# EAGLE design SparkFun_Qwiic_pHAT_Extension (EAGLE 9.5.2)
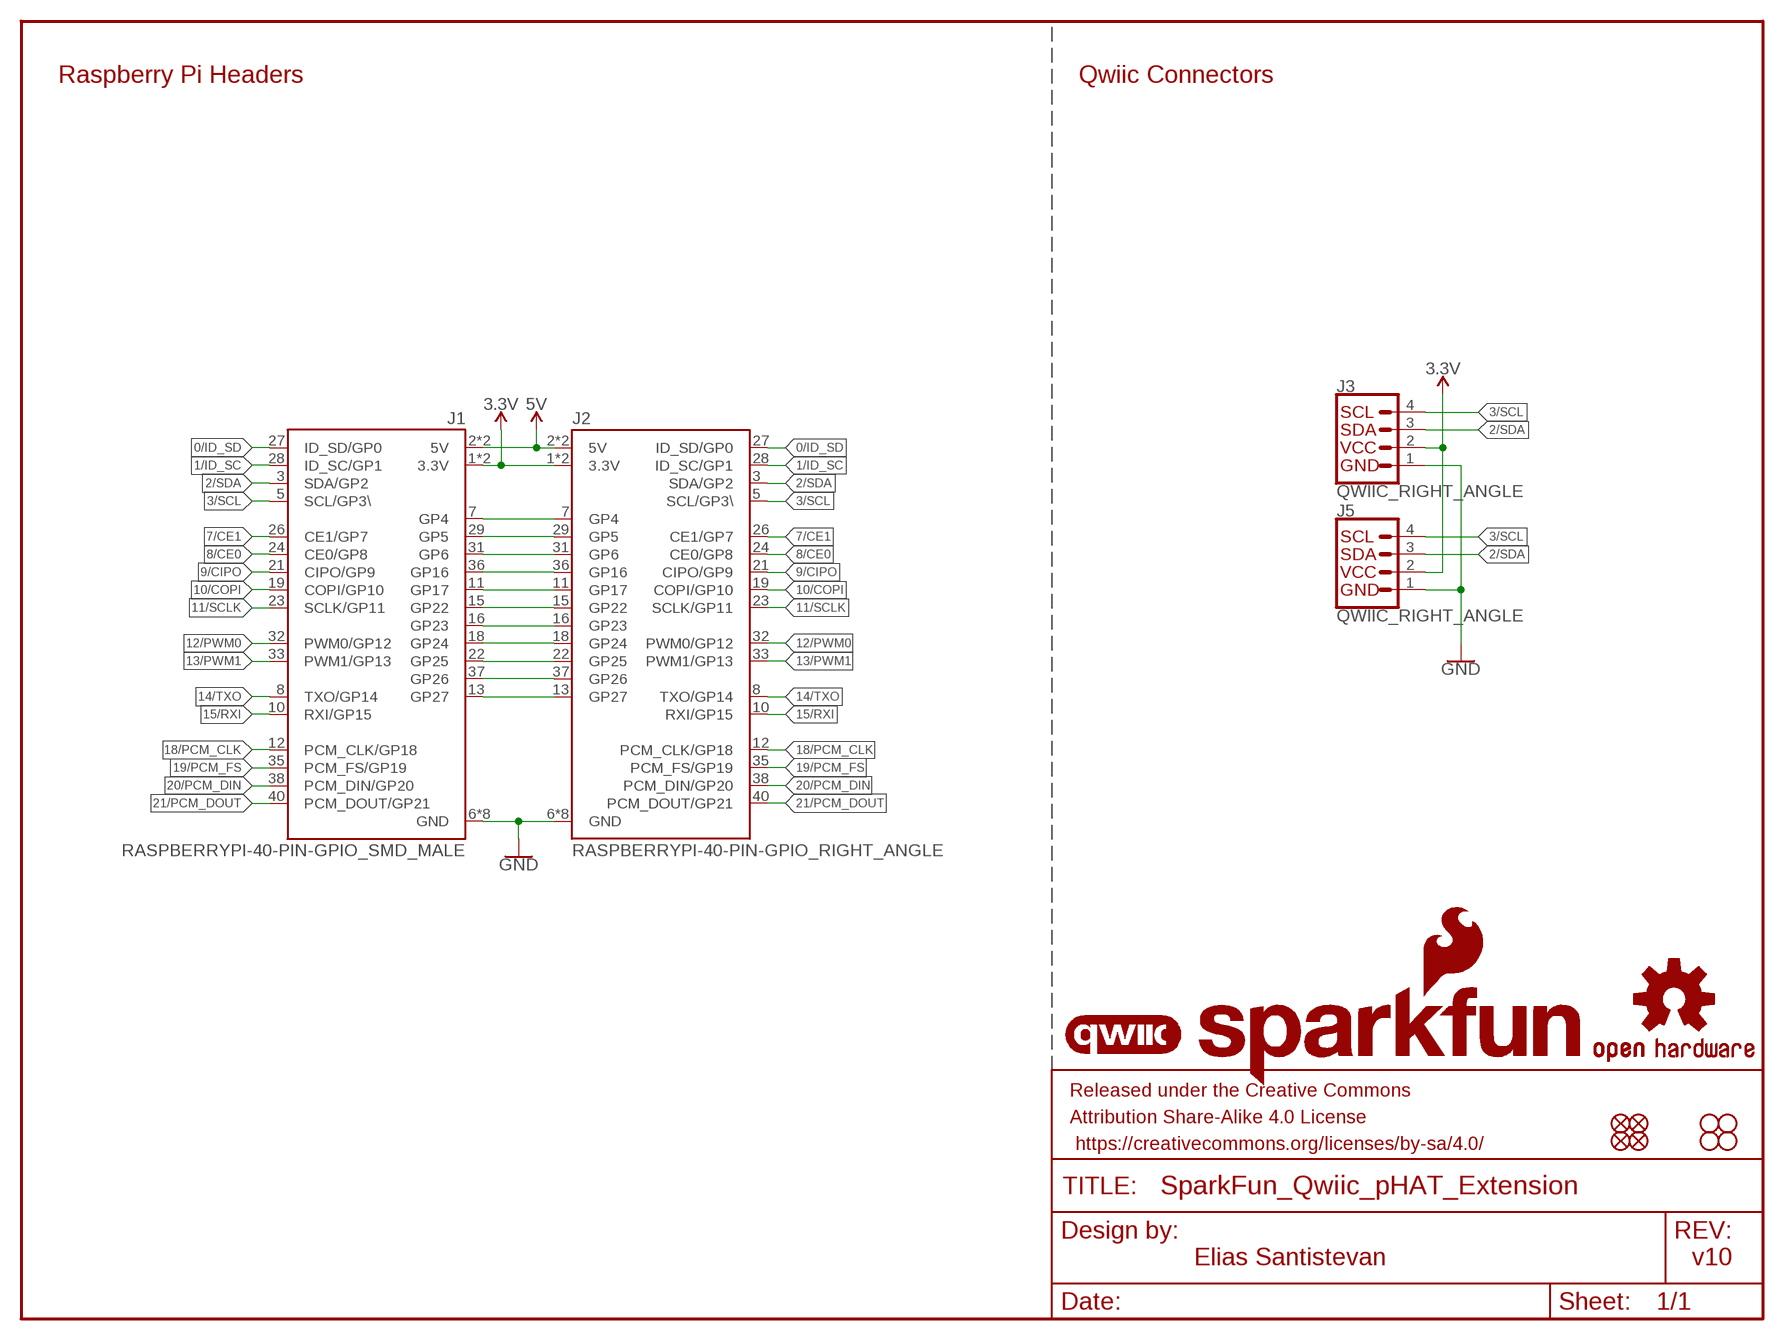
[diagram p0: schematic, sheet 1]

## Parts
FD1  FIDUCIALUFIDUCIAL  [FIDUCIAL-MICRO]
FD2  FIDUCIALUFIDUCIAL  [FIDUCIAL-MICRO]
FD3  FIDUCIALUFIDUCIAL  [FIDUCIAL-MICRO]
FD4  FIDUCIALUFIDUCIAL  [FIDUCIAL-MICRO]
FRAME1  FRAME-LETTER  [CREATIVE_COMMONS]
H1  STAND-OFFTIGHT  [STAND-OFF-TIGHT]
H2  STAND-OFFTIGHT  [STAND-OFF-TIGHT]
H3  STAND-OFFTIGHT  [STAND-OFF-TIGHT]
H4  STAND-OFFTIGHT  [STAND-OFF-TIGHT]
J1  RASPBERRYPI-40-PIN-GPIO_SMD_MALE  [RASPBERRY_PI_HAT_40_PIN_SMD_MALE]
J2  RASPBERRYPI-40-PIN-GPIO_RIGHT_ANGLE  [2X20_RIGHT_ANGLE]
J3  QWIIC_RIGHT_ANGLE  QWIIC_CONNECTORJS-1MM  [JST04_1MM_RA]
J5  QWIIC_RIGHT_ANGLE  QWIIC_CONNECTORJS-1MM  [JST04_1MM_RA]
LOGO1  QWIIC_LOGO_5MM  [QWIIC_5MM]
LOGO2  SFE_LOGO_NAME_FLAME.2_INCH  [SFE_LOGO_NAME_FLAME_.2]
LOGO3  OSHW-LOGOM  [OSHW-LOGO-M]

## Nets
0/ID_SD: J1.27(ID_SD/GP0) J2.27(ID_SD/GP0)
1/ID_SC: J1.28(ID_SC/GP1) J2.28(ID_SC/GP1)
2/SDA: J1.3(SDA/GP2) J2.3(SDA/GP2) J3.3 J5.3
3.3V: J1.1(3.3V) J1.17(3.3V) J2.1(3.3V) J2.17(3.3V) J3.2 J5.2
3/SCL: J1.5(SCL/GP3\) J2.5(SCL/GP3\) J3.4 J5.4
5V: J1.2(5V) J1.4(5V) J2.2(5V) J2.4(5V)
7/CE1: J1.26(CE1/GP7) J2.26(CE1/GP7)
8/CE0: J1.24(CE0/GP8) J2.24(CE0/GP8)
9/CIPO: J1.21(CIPO/GP9) J2.21(CIPO/GP9)
10/COPI: J1.19(COPI/GP10) J2.19(COPI/GP10)
11/SCLK: J1.23(SCLK/GP11) J2.23(SCLK/GP11)
12/PWM0: J1.32(PWM0/GP12) J2.32(PWM0/GP12)
13/PWM1: J1.33(PWM1/GP13) J2.33(PWM1/GP13)
14/TXO: J1.8(TXO/GP14) J2.8(TXO/GP14)
15/RXI: J1.10(RXI/GP15) J2.10(RXI/GP15)
18/PCM_CLK: J1.12(PCM_CLK/GP18) J2.12(PCM_CLK/GP18)
19/PCM_FS: J1.35(PCM_FS/GP19) J2.35(PCM_FS/GP19)
20/PCM_DIN: J1.38(PCM_DIN/GP20) J2.38(PCM_DIN/GP20)
21/PCM_DOUT: J1.40(PCM_DOUT/GP21) J2.40(PCM_DOUT/GP21)
GND: J1.6(GND) J1.9(GND) J1.14(GND) J1.20(GND) J1.25(GND) J1.30(GND) J1.34(GND) J1.39(GND) J2.6(GND) J2.9(GND) J2.14(GND) J2.20(GND) J2.25(GND) J2.30(GND) J2.34(GND) J2.39(GND) J3.1 J5.1
GP4: J1.7(GP4) J2.7(GP4)
GP5: J1.29(GP5) J2.29(GP5)
GP6: J1.31(GP6) J2.31(GP6)
GP16: J1.36(GP16) J2.36(GP16)
GP17: J1.11(GP17) J2.11(GP17)
GP22: J1.15(GP22) J2.15(GP22)
GP23: J1.16(GP23) J2.16(GP23)
GP24: J1.18(GP24) J2.18(GP24)
GP25: J1.22(GP25) J2.22(GP25)
GP26: J1.37(GP26) J2.37(GP26)
GP27: J1.13(GP27) J2.13(GP27)

## Notes on the sheet
- Raspberry Pi Headers | Qwiic Connectors
- Elias Santistevan | v10

## Library data of the parts
FD1-FD4 = SparkFun-Aesthetics:FIDUCIAL: Fiducial Alignment Points Point-of-reference for pick-and-place machines and other optical instruments.
FRAME1 = SparkFun-Aesthetics:FRAME-LETTER: Schematic Frame - Letter Standard 8.5x11 US Letter frame
H1-H4 = SparkFun-Hardware:STAND-OFF: Stand Off Drill holes for mechanically mounting via screws, standoffs, etc. Note: Use the keepout ring to avoid running the screw head into surrounding components. Variant Overviews STAND-OFF - Mechanical footprint for a #4 phillips button head screw. STAND-OFF-TIGHT - Mechanical footprint for a #4 phillips button head screw, Example SparkFun Products Screw - Phillips Head (1/4", 4-40, 10 pack) <https://www.sparkfun.com/products/10453> (PRT-10453) Screw - Phillips Head (1/2", 4-40, 10 pack) <https://www.sparkfun.com/products/10452> (PRT-10452) Screw - Phillips Head (3/4", 4-40, 10 pack) <https://www.sparkfun.com/products/10451> (PRT-10451) Screw - Phillips Head (1", 4-40, 10 pack) <https://www.sparkfun.com/products/10450> (PRT-10450)
J1 = SparkFun-Connectors:RASPBERRYPI-40-PIN-GPIO: Raspberry Pi GPIO Header 2x20 pin connector, as found on B, B+, A+ models. Both shrouded PTH and SMT versions available. SparkFun Products: GPIO Shrouded Header <https://www.sparkfun.com/products/13054>- PTH SparkFun Pi Wedge (Preassembled) <https://www.sparkfun.com/products/13717>; PROD_ID: CONN-14915
J2 = SparkFun-Connectors:RASPBERRYPI-40-PIN-GPIO: Raspberry Pi GPIO Header 2x20 pin connector, as found on B, B+, A+ models. Both shrouded PTH and SMT versions available. SparkFun Products: GPIO Shrouded Header <https://www.sparkfun.com/products/13054>- PTH SparkFun Pi Wedge (Preassembled) <https://www.sparkfun.com/products/13717>
J3 J5 = SparkFun-Connectors:QWIIC_CONNECTOR: SparkFun I2C Standard Qwiic Connector An SMD 1mm pitch JST connector makes it easy and quick (get it? Qwiic?) to connect I2C devices to each other. The Qwiic system <http://www.sparkfun.com/qwiic> enables fast and solderless connection between popular platforms and various sensors and actuators. We carry 200mm <https://www.sparkfun.com/products/14204>, 100mm <https://www.sparkfun.com/products/14205>, 50mm <https://www.sparkfun.com/products/14206>, and breadboard friendly <https://www.sparkfun.com/products/14207> Qwiic cables. We also offer 10 pcs strips <https://www.sparkfun.com/products/14323> the SMD connectors.; PROD_ID: CONN-13694
LOGO1 = SparkFun-Aesthetics:QWIIC_LOGO: Qwiic Logos for placement on schematic and PCB. The 5.5mm silk logo is best for placing next to Qwiic connector.
LOGO2 = SparkFun-Aesthetics:SFE_LOGO_NAME_FLAME: SparkFun Font Logo w/ Flame This is the SparkFun full logo. The logo on the schematic will always be the same size; the package variant is the height of the flame part of the logo. Default layer for the logo on the board is tSilk.
LOGO3 = SparkFun-Aesthetics:OSHW-LOGO: Open-Source Hardware (OSHW) Logo This logo indicates the piece of hardware it is found on incorporates a OSHW license and/or adheres to the definition of open source hardware found here: http://freedomdefined.org/OSHW

## Board
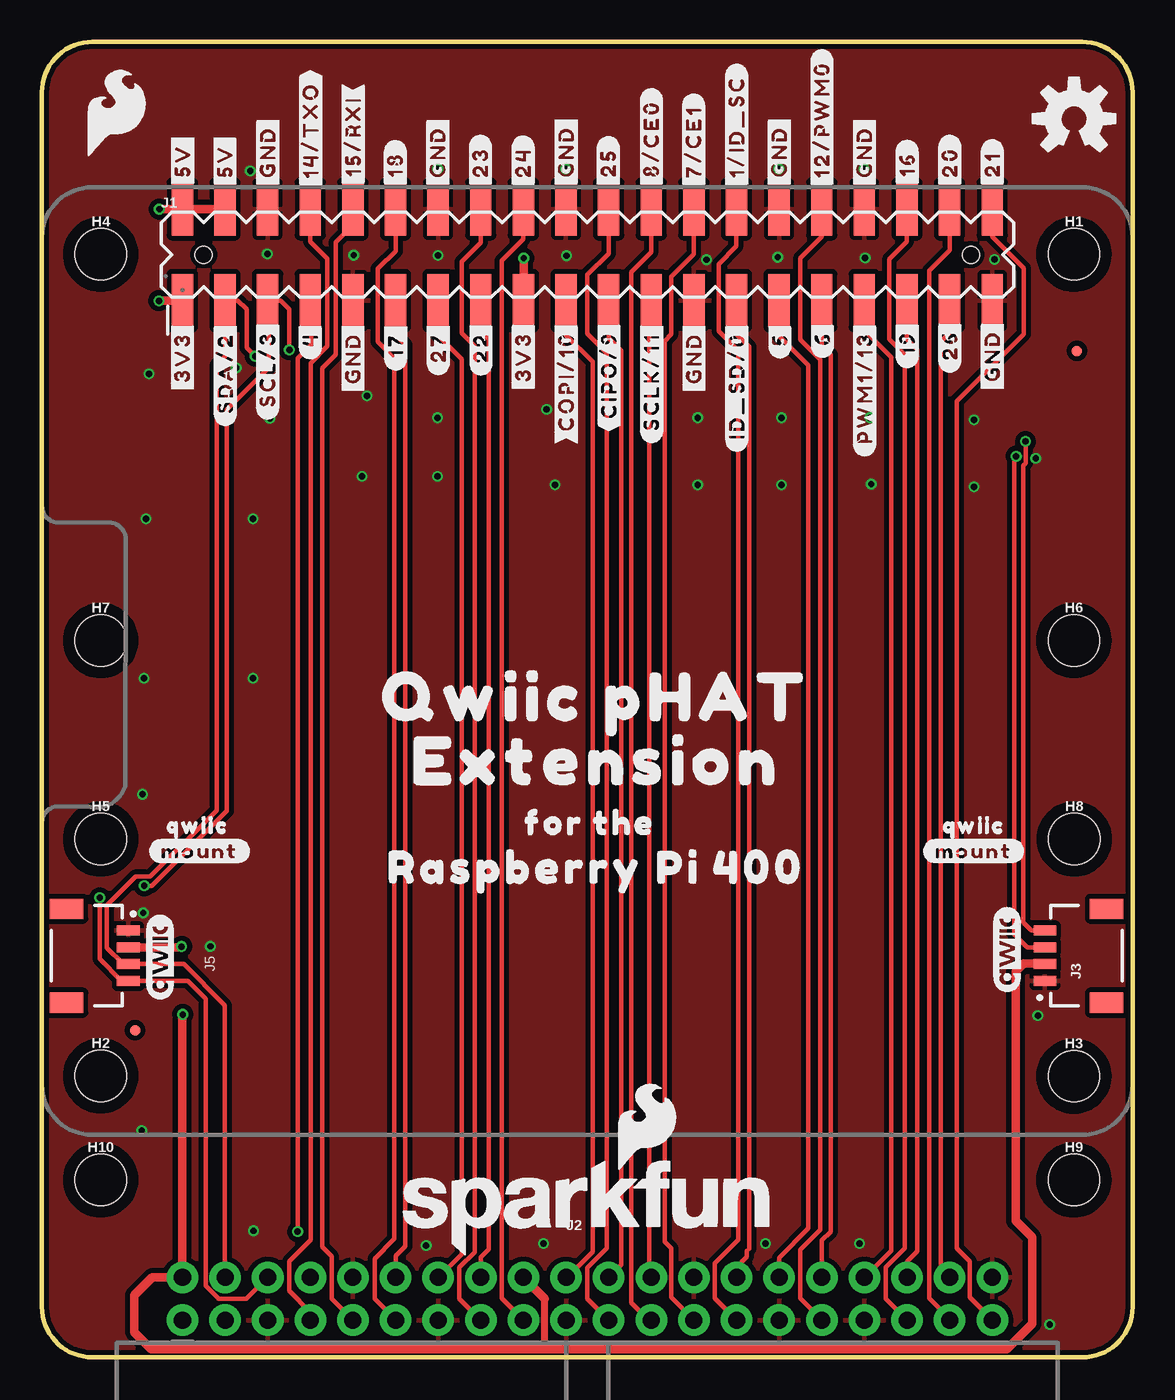
[diagram p1: board, top side]
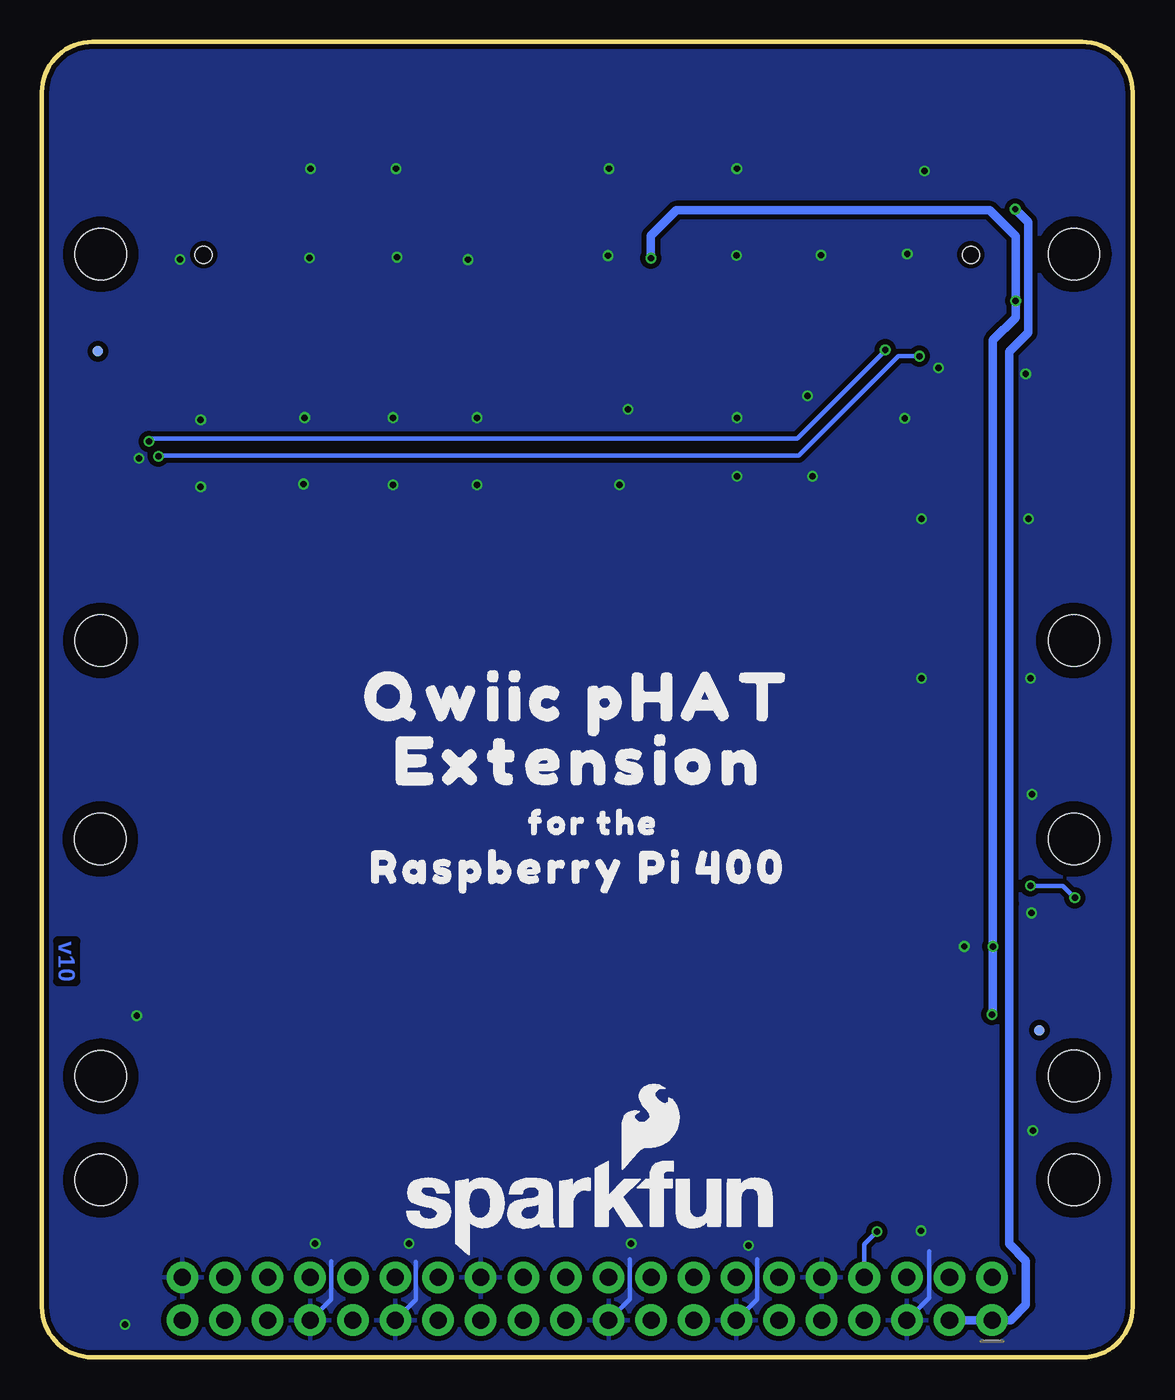
[diagram p2: board, bottom side, seen from below]

Size 65 x 78.42 mm. Coordinates in mm from the lower left corner, seen from the top.
Outline: 0,75.42 0,3 arc90 3,0 62,0 arc90 65,3 65,75.42 arc90 62,78.42 3,78.42 arc90 0,75.42
Copper layers (1*16): Top 0.035mm / dielectric 1.5mm / Bottom 0.035mm
Design rules "SparkFun-2-layer-FAB-LIMIT": minimum track width 4mil, minimum drill 6mil, track to track 4mil, track to pad 4mil, pad to pad 4mil, via to via 4mil, smd to smd 4mil, copper to edge 4mil, drill to drill 4mil, minimum pad ring 5mil, minimum via ring 5mil, stop-mask expansion 4mil, vias tented up to drill 25mil, thermal gap 10mil

### Footprints (pad centres in the part's own frame; a part is rotated, then mirrored left to right if it is on the bottom)
FIDUCIAL-MICRO = smd 0.635 x 0.635: 1 0,0
STAND-OFF-TIGHT = hole 3.048: 0,0
RASPBERRY_PI_HAT_40_PIN_SMD_MALE = smd 1.27 x 3.175: 1 0,-1.46; 2 0,4; 3 2.54,-1.46; 4 2.54,4; 5 5.08,-1.46; 6 5.08,4; 7 7.62,-1.46; 8 7.62,4; 9 10.16,-1.46; 10 10.16,4; 11 12.7,-1.46; 12 12.7,4; 13 15.24,-1.46; 14 15.24,4; 15 17.78,-1.46; 16 17.78,4; 17 20.32,-1.46; 18 20.32,4; 19 22.86,-1.46; 20 22.86,4; 21 25.4,-1.46; 22 25.4,4; 23 27.94,-1.46; 24 27.94,4; 25 30.48,-1.46; 26 30.48,4; 27 33.02,-1.46; 28 33.02,4; 29 35.56,-1.46; 30 35.56,4; 31 38.1,-1.46; 32 38.1,4; 33 40.64,-1.46; 34 40.64,4; 35 43.18,-1.46; 36 43.18,4; 37 45.72,-1.46; 38 45.72,4; 39 48.26,-1.46; 40 48.26,4 | hole 1: 1.27,1.27; 46.99,1.27
2X20_RIGHT_ANGLE = drill 1.016 pad 1.88: 1 -24.125,1.25; 2 -24.125,-1.29; 3 -21.585,1.25; 4 -21.585,-1.29; 5 -19.045,1.25; 6 -19.045,-1.29; 7 -16.505,1.25; 8 -16.505,-1.29; 9 -13.965,1.25; 10 -13.965,-1.29; 11 -11.425,1.25; 12 -11.425,-1.29; 13 -8.885,1.25; 14 -8.885,-1.29; 15 -6.345,1.25; 16 -6.345,-1.29; 17 -3.805,1.25; 18 -3.805,-1.29; 19 -1.265,1.25; 20 -1.265,-1.29; 21 1.275,1.25; 22 1.275,-1.29; 23 3.815,1.25; 24 3.815,-1.29; 25 6.355,1.25; 26 6.355,-1.29; 27 8.895,1.25; 28 8.895,-1.29; 29 11.435,1.25; 30 11.435,-1.29; 31 13.975,1.25; 32 13.975,-1.29; 33 16.515,1.25; 34 16.515,-1.29; 35 19.055,1.25; 36 19.055,-1.29; 37 21.595,1.25; 38 21.595,-1.29; 39 24.135,1.25; 40 24.135,-1.29
JST04_1MM_RA = smd 0.6 x 1.35: 1 -1.5,0; 2 -0.5,0; 3 0.5,0; 4 1.5,0 | smd 1.2 x 2: NC1 2.8,-3.675; NC2 -2.8,-3.675

### Placement (x,y rotation side)
FD1  5.55,19.49 0 top
FD2  61.67,59.99 0 top
FD3  61.67,59.98 0 bottom
FD4  5.55,19.49 0 bottom
FRAME1  17.1,-15.9 0 top  (outside the outline)
H1  61.5,65.76 0 top
H2  3.5,16.78 0 top
H3  61.5,16.76 0 top
H4  3.5,65.76 0 top
H5  STAND-OFFTIGHT  [STAND-OFF-TIGHT]  3.5,30.9 0 top
H6  STAND-OFFTIGHT  [STAND-OFF-TIGHT]  61.5,42.74 0 top
H7  STAND-OFFTIGHT  [STAND-OFF-TIGHT]  3.5,42.73 0 top
H8  STAND-OFFTIGHT  [STAND-OFF-TIGHT]  61.52,30.9 0 top
H9  STAND-OFFTIGHT  [STAND-OFF-TIGHT]  61.5,10.58 0 top
H10  STAND-OFFTIGHT  [STAND-OFF-TIGHT]  3.5,10.58 0 top
J1  8.37,64.46 0 top
J2  32.5,3.51 0 top
J3  59.77,23.94 90 top
J5  5.14,23.94 270 top
LOGO1  7.02,23.83 90 top
LOGO2  32.49,8.93 0 top
LOGO3  61.51,73.84 0 top
LOGO4  QWIIC_LOGO_5MM  [QWIIC_5MM]  57.5,24.28 90 top
LOGO5  SFE_LOGO_NAME_FLAME.2_INCH  [SFE_LOGO_NAME_FLAME_.2]  32.29,8.93 0 bottom
U$1  [#SDA#2#4]  10.93,58.67 90 top
U$2  [#SCL#3#4]  13.45,58.9 90 top
U$3  [FOR_THE40034]  32.65,31.87 0 top
U$4  [#3V3#0]  8.38,59.6 90 top
U$5  [#3V3#0]  28.69,59.63 90 top
U$6  [#4#4]  16,60.66 90 top
U$7  [#5#28]  43.98,60.68 90 top
U$8  [#5V#28]  8.39,71.34 90 top
U$9  [#5V#28]  10.91,71.32 90 top
U$10  [#6#28]  46.52,60.73 90 top
U$11  [#7#CE1#29]  38.84,72.46 90 top
U$12  [#8#CE0#29]  36.32,72.63 90 top
U$13  [FOR_THE40034]  32.14,31.87 0 bottom
U$14  [#SCLK#11#28]  36.33,58.16 90 top
U$15  [#ID_SD#0#28]  41.41,57.91 90 top
U$16  [#12#PWM0#29]  46.48,73.78 90 top
U$17  [#PWM1#13#28]  49.03,57.78 90 top
U$18  [#14#TXO#29]  16.01,73.15 90 top
U$19  [#15#RXI#29]  18.55,72.77 90 top
U$20  [#16#29]  51.56,71.11 90 top
U$21  [#17#5]  21.08,60.31 90 top
U$22  [#18#29]  21.06,71.08 90 top
U$23  [#19#28]  51.56,60.44 90 top
U$24  [#20#29]  54.1,71.24 90 top
U$25  [#21#29]  56.64,71.11 90 top
U$26  [#22#28]  26.16,60.19 90 top
U$27  [#23#29]  26.14,71.24 90 top
U$28  [#24#29]  28.68,71.21 90 top
U$29  [#25#29]  33.76,71.21 90 top
U$30  [#26#28]  54.1,60.31 90 top
U$31  [#27#18]  23.62,60.19 90 top
U$32  [#GND#28]  18.54,59.55 90 top
U$33  [#GND#28]  38.86,59.55 90 top
U$34  [#GND#28]  56.64,59.68 90 top
U$35  [#GND#28]  49.02,71.85 90 top
U$36  [#GND#28]  43.94,71.87 90 top
U$37  [#GND#28]  31.24,71.87 90 top
U$38  [#GND#28]  23.59,71.85 90 top
U$39  [#GND#28]  13.46,71.85 90 top
U$40  [#1#ID_SC#29]  41.4,73.35 90 top
U$51  [#CIPO#9#28]  33.79,58.54 90 top
U$52  [#COPI#10#28]  31.25,58.16 90 top
U$75  [QWIIC_PHAT31]  33.03,39.36 0 top
U$76  [EXTENSION32]  33.03,35.55 0 top
U$81  [SFE_LOGO_FLAME_.2]  4.46,74.16 0 top
U$82  [#MOUNT#29]  9.39,30.18 0 top
U$83  [#MOUNT#29]  55.52,30.18 0 top
U$84  [QWIIC30]  9.27,31.7 0 top
U$85  [QWIIC30]  55.52,31.7 0 top
U$86  [RASPBERRY_PI_40033]  33.03,29.2 0 top
U$89  [QWIIC_PHAT31]  33.03,39.36 0 bottom
U$90  [EXTENSION32]  33.03,35.55 0 bottom
U$91  [RASPBERRY_PI_40033]  33.03,29.2 0 bottom

### Tracks (layer width: path | path; a pad name or v marks a point on that pad's centre or on a via)
0/ID_SD
  Top 0.254: J1.27 41.39,60.99 42.14,60.24 42.14,6.47 42.01,6.34 42.01,5.99 41.39,5.38 J2.27
1/ID_SC
  Top 0.254: J1.28 41.39,66.23 40.33,65.17 40.33,61.17 41.01,60.49 41.39,60.11 41.51,59.99 41.51,6.99 40.11,5.59 40.11,3.51 J2.28
2/SDA  (via drill 0.38)
  Top 0.254: v12.71,59.68 12.2,60.19 12.2,62.48 11.68,63 J1.3 10.93,62.98 10.93,59.68 10.41,59.16 10.41,32.61 6.46,28.66 5.59,28.66 3.87,26.94 3.87,24.42 4.84,23.44 J5.3 8.45,23.44 10.89,20.99 10.89,4.78 J2.3 | J3.3 58.7,24.44 57.93,25.22 57.93,53.59 v58.06,53.72
  Bottom 0.254: v12.71,59.68 13.98,59.68 19.9,53.76 58.02,53.76 v58.06,53.72
3.3V  (via drill 0.38)
  Top 0.406: 29.97,0.49 29.97,3.49
  Top 0.508: J1.1 6.98,63 v6.97,62.99 | J1.17 28.71,63.02 v28.71,65.53 | 29.97,3.49 J2.17 | v8.39,20.44 8.38,20.42 J2.1 6.56,4.76 5.51,3.71 5.51,1.49 6.51,0.49 29.97,0.49 57.51,0.49 59.01,1.99 59.01,7.14 58.02,8.13 58.02,23 58.51,23.49 59.72,23.49 J3.2 | J5.2 8.27,24.44 v8.33,24.49
  Bottom 0.508: v28.71,65.53 28.71,66.88 27.21,68.38 8.51,68.38 6.97,66.84 v6.97,62.99 6.97,62 8.33,60.64 v8.33,24.49 8.33,20.51 v8.39,20.44
3/SCL  (via drill 0.38)
  Top 0.254: v14.74,60.06 14.74,62.48 14.23,62.99 13.51,62.99 13.5,63 J1.5 13.51,62.94 13.51,58.99 11.01,56.49 11.01,32.58 6.55,28.11 v6.1,28.11 | J3.4 58.97,25.44 58.48,25.93 58.48,53.17 58.62,53.31 v58.62,54.6 | J2.5 12.19,3.49 10.51,3.49 10.51,3.51 9.75,4.28 9.75,21.37 8.68,22.44 J5.4 4.73,22.44 3.43,23.74 3.43,27.38 v3.45,27.39
  Bottom 0.254: 58.45,54.76 20,54.76 14.74,60.02 v14.74,60.06 | v58.62,54.6 58.45,54.76 | 58.45,54.76 | v6.1,28.11 4.17,28.11 v3.45,27.39
5V  (via drill 0.38)
  Top 0.508: J1.4 J1.2 7.01,68.46 v7,68.45
  Bottom 0.508: J2.4 J2.2 7.26,2.22 6.36,3.12 6.36,5.75 7.37,6.76 7.37,27.03 7.35,27.05 7.35,59.96 6.23,61.08 6.23,67.69 v7,68.45
7/CE1
  Top 0.254: J1.26 38.85,65.76 37.51,64.42 37.51,60.99 37.11,60.59 37.11,6.89 37.51,6.49 37.51,3.57 J2.26
8/CE0
  Top 0.254: J1.24 36.31,65.89 35.12,64.7 35.12,3.26 36.16,2.22 J2.24
9/CIPO
  Top 0.254: J1.21 33.77,60.75 34.52,60 34.52,5.5 J2.21
10/COPI
  Top 0.254: J1.19 31.23,60.95 32.82,59.36 32.82,6.29 31.3,4.76 J2.19
11/SCLK
  Top 0.254: J1.23 36.2,62.89 36.2,4.88 J2.23
12/PWM0
  Top 0.254: J1.32 46.47,66.8 45.2,65.53 45.2,60.66 46.38,59.48 46.38,7.61 45.18,6.4 45.18,3.52 J2.32
13/PWM1
  Top 0.254: J1.33 49.01,61.23 50.61,59.63 50.61,6.34 50.29,6.03 50.28,6.03 J2.33
14/TXO
  Top 0.254: J1.8 15.99,66.51 17.01,65.49 17.01,60.27 16.01,59.27 16.01,6.99 14.73,5.71 14.73,3.96 15.99,2.7 J2.8
15/RXI
  Top 0.254: J1.10 18.53,67.51 17.51,66.49 17.51,59.77 16.7,58.96 16.7,6.59 17.27,6.03 17.27,3.49 J2.10
18/PCM_CLK
  Top 0.254: J1.12 21.07,65.96 20.01,64.9 20.01,60.55 21.01,59.55 21.01,7.07 19.82,5.88 19.82,3.48 J2.12
19/PCM_FS
  Top 0.254: J1.35 51.55,60.71 52.17,60.09 52.17,6.33 51.55,5.72 J2.35
20/PCM_DIN
  Top 0.254: J1.38 54.09,65.99 52.87,64.77 52.87,3.52 54.09,2.29 J2.38
21/PCM_DOUT
  Top 0.254: J1.40 56.63,66.82 58.51,64.94 58.51,60.99 54.51,56.99 54.51,6.49 55.29,5.71 55.29,3.57 J2.40
GND  (via drill 0.38)
  Bottom 0.254: J2.6 12.12,3.56 12.12,6.33 | J2.30 42.73,3.42 42.73,5.68 | J2.34 47.76,3.47 47.76,5.73 | J2.14 22.36,3.47 22.36,5.84 | J2.20 29.98,3.47 29.98,5.84
  other vias: 6.37,58.63 13.58,55.98 23.58,56.02 23.58,52.52 30.58,52.02 30.08,56.52 39.08,56.02 39.08,52.02 44.08,52.02 44.08,56.02 49.34,56.02 49.42,52.06 56.78,65.45 55.54,51.89 19.38,57.32 19.08,52.52 10.03,24.5 59.35,20.36 55.54,55.89 13.43,65.78 23.61,65.7 31.26,65.68 39.6,65.44 43.85,65.59 49.06,65.54 18.58,65.71 11.58,58.98 6,33.56 12.61,7.54 5.95,13.51 6.08,40.48 6.2,49.98 12.58,49.98 12.58,40.48 48.72,6.77 60.06,1.96 12.41,70.73 23.59,70.86 31.21,70.86 43.91,70.86 48.99,70.86 43.13,6.77 22.9,6.65 29.88,6.78 6.03,26.5 59.22,53.6
  pour Top (isolate 0.305): 0,0 0,78.42 65,78.42 65,0
  pour Bottom (isolate 0.305): 0,0 0,78.42 65,78.42 65,0
GP4  (via drill 0.38)
  Top 0.254: J1.7 16.06,62.93 16.06,60.38 15.24,59.56 v15.24,7.49
  Bottom 0.254: J2.7 15.99,6.74 v15.24,7.49
GP5
  Top 0.254: J1.29 43.93,60.89 45.67,59.15 45.67,7.68 43.93,5.94 J2.29
GP6
  Top 0.254: J1.31 46.47,60.32 47,59.79 47,7.49 46.48,6.97 J2.31
GP16
  Top 0.254: J1.36 51.55,66.52 50.49,65.46 50.49,60.71 51.41,59.79 51.41,6.49 50.29,5.37 50.29,3.49 J2.36
GP17
  Top 0.254: J1.11 21.07,60.95 21.65,60.37 21.65,6.61 21.08,6.04 J2.11
GP22
  Top 0.254: J1.15 26.15,61.17 26.63,60.69 26.63,6.43 26.16,5.95 J2.15
GP23
  Top 0.254: J1.16 26.15,66.45 25.01,65.31 25.01,61.05 25.79,60.27 25.79,6.27 24.88,5.36 24.88,3.5 J2.16
GP24
  Top 0.254: J1.18 28.69,66.67 27.41,65.39 27.41,6.79 27.41,3.51 J2.18
GP25
  Top 0.254: J1.22 33.77,65.8 32.51,64.54 32.51,61.02 33.66,59.88 33.66,6.49 32.51,5.35 32.51,3.49 J2.22
GP26
  Top 0.254: J1.37 54.09,61.08 53.56,60.55 53.56,5.29 J2.37
GP27
  Top 0.254: J1.13 23.61,60.92 25.01,59.52 25.01,6.15 J2.13

### Text on the board
Bottom: v10
tDocu: Elias Santistevan